# Altium schematic sheet SENSORS.SchDoc
size A4
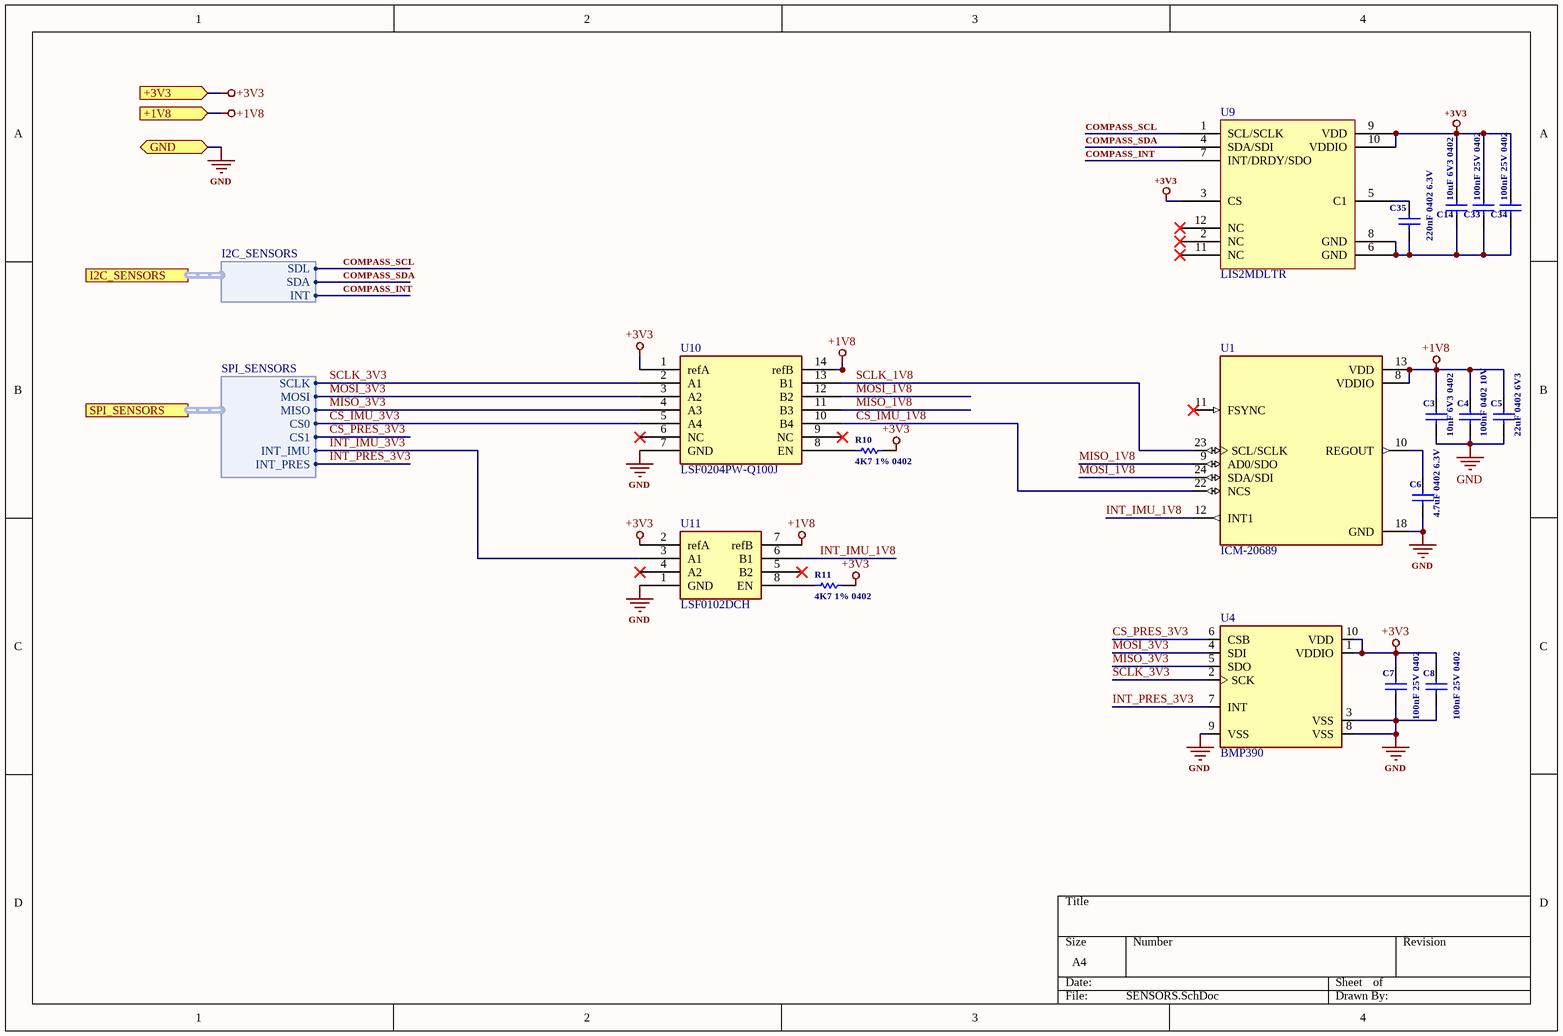
[diagram p0: SENSORS.SchDoc]

## Parts
C3  10nF 6V3 0402
C4  100nF 0402 10V
C5  22uF 0402 6V3
C6  4.7uF 0402 6.3V
C7  100nF 25V 0402
C8  100nF 25V 0402
C14  10uF 6V3 0402
C33  100nF 25V 0402
C34  100nF 25V 0402
C35  220nF 0402 6.3V
R10  4K7 1% 0402  [Resistor_0402]
R11  4K7 1% 0402  [Resistor_0402]
U1  ICM-20689
U4  BMP390
U9  LIS2MDLTR
U10  LSF0204PW-Q100J  [TSOP65P640X110-14N]
U11  LSF0102DCH

## Ports
+1V8 (in), +3V3 (in), GND (bidir), I2C_SENSORS (harness I2C_SENSORS), SPI_SENSORS (harness SPI_SENSORS)

## Harnesses
SPI_SENSORS: SCLK, MOSI, MISO, CS0, CS1, INT_IMU, INT_PRES
I2C_SENSORS: SDL, SDA, INT

## Nets
+1V8: C3.2 C4.2 C5.2 U1.8(VDDIO) U1.13(VDD) U10.14(refB) U11.7(refB) ; port +1V8
+3V3: C7.2 C8.2 C14.2 C33.2 C34.2 R10.2 R11.2 U4.1(VDDIO) U4.10(VDD) U9.3(CS) U9.9(VDD) U9.10(VDDIO) U10.1(refA) U11.2(refA) ; port +3V3
GND: C3.1 C4.1 C5.1 C6.1 C7.1 C8.1 U1.18(GND) U4.3(VSS) U4.8(VSS) U4.9(VSS) U10.7(GND) U11.1(GND) ; port GND
COMPASS_INT: U9.7(INT/DRDY/SDO) ; port I2C_SENSORS.INT
COMPASS_SCL: U9.1(SCL/SCLK) ; port I2C_SENSORS.SDL
COMPASS_SDA: U9.4(SDA/SDI) ; port I2C_SENSORS.SDA
CS_IMU_1V8: U1.22(NCS) U10.10(B4)
CS_IMU_3V3: U10.5(A4) ; port SPI_SENSORS.CS0
CS_PRES_3V3: U4.6(CSB) ; port SPI_SENSORS.CS1
INT_IMU_1V8: U1.12(INT1) U11.6(B1)
INT_IMU_3V3: U11.3(A1) ; port SPI_SENSORS.INT_IMU
INT_PRES_3V3: U4.7(INT) ; port SPI_SENSORS.INT_PRES
MISO_1V8: U1.9(AD0/SDO) U10.11(B3)
MISO_3V3: U4.5(SDO) U10.4(A3) ; port SPI_SENSORS.MISO
MOSI_1V8: U1.24(SDA/SDI) U10.12(B2)
MOSI_3V3: U4.4(SDI) U10.3(A2) ; port SPI_SENSORS.MOSI
SCLK_1V8: U1.23(SCL/SCLK) U10.13(B1)
SCLK_3V3: U4.2(SCK) U10.2(A1) ; port SPI_SENSORS.SCLK
NetC6_2: C6.2 U1.10(REGOUT)
NetC14_1: C14.1 C33.1 C34.1 C35.2 U9.6(GND) U9.8(GND)
NetC35_1: C35.1 U9.5(C1)
NetR10_1: R10.1 U10.8(EN)
NetR11_1: R11.1 U11.8(EN)

Not connected (* = marked no-connect by the designer): U1 11(FSYNC)*; U9 2(NC)* 11(NC)* 12(NC)*; U10 6(NC)* 9(NC)*; U11 4(A2)* 5(B2)*

## Library data of the parts
C3 = 04026C103KAT2A  10nF 6.3V: Supplier 1: Digi-Key; Supplier Part Number 1: 478-04026C103KAT2ACT-ND; Value: 10nF 6V3 0402
C4 = CL05A104KP5NNNC 100nF 0402 10V: Cap Ceramic 0.1uF 10V X5R 10% SMD 0402 85C Paper T/R; Manufacturer: Samsung; Capacitance: 100000 pF; Supplier 1: Digi-Key; Manufacturer Part Number: CL05A104KP5NNNC; Stock 1: 5595689; Pricing 1: 1=0.1, 10=0.021, 50=0.0116, 100=0.0094, 500=0.0067, 1000=0.0053, 2500=0.0048, 5000=0.0044 (USD); Case Size/Dimension: 0402; Dielectric: X5R; Tolerance (%): ±10 %; Rated Voltage: 10 V; ComponentLink1URL: https://www.distrelec.biz/Web/Downloads/_e/ng/MLCC_CatalogDownload2013_ENG.pdf?mime=application%2Fpdf&src-supplier=Distrelec; ComponentLink1Description: https://www.distrelec.biz/Web/Downloads/_e/ng/MLCC_CatalogDownload2013_ENG.pdf?mime=application%2Fpdf&src-supplier=Distrelec; ComponentLink2URL: https://media.digikey.com/pdf/Data%20Sheets/Samsung%20PDFs/CL_Series_MLCC_ds.pdf?src-supplier=Digi-Key; ComponentLink2Description: https://media.digikey.com/pdf/Data%20Sheets/Samsung%20PDFs/CL_Series_MLCC_ds.pdf?src-supplier=Digi-Key; ComponentLink3URL: http://www1.futureelectronics.com/doc/SAMSUNG%20PASSIVE/CL05B104KQ5NNNC.pdf?src-supplier=Future+Electronics; ComponentLink3Description: http://www1.futureelectronics.com/doc/SAMSUNG%20PASSIVE/CL05B104KQ5NNNC.pdf?src-supplier=Future+Electronics; ComponentLink4URL: https://www.verical.com/server-webapp/html/getDatasheet?partID=358611&src-supplier=Verical; ComponentLink4Description: https://www.verical.com/server-webapp/html/getDatasheet?partID=358611&src-supplier=Verical; Supplier Part Number 1: 1276-1022-1-ND; Value: 100nF 0402 10V
C5 = CL05A226MQ5N6J8 22uF 0402 6V3: CL05 Series 22 uF 6.3 V ±20% Tolerance X5R SMT Multilayer Ceramic Capacitor; Manufacturer: Samsung; Categories: Capacitors; Capacitance: 22µF; Voltage - Rated: 6.3V; Supplier 1: Digi-Key; Manufacturer Part Number: CL05A226MQ5N6J8; Stock 1: 135434; Pricing 1: 1=0.53, 10=0.366, 50=0.2564, 100=0.2197, 500=0.1648, 1000=0.1392, 2500=0.1318 (USD); Series: CL; Packaging: Tape & Reel (TR); Part Status: Active; Tolerance: ±20%; Temperature Coefficient: X5R; Operating Temperature: -55°C ~ 85°C; Features: -; Ratings: -; Applications: General Purpose; Failure Rate: -; Mounting Type: Surface Mount, MLCC; Package / Case: 0402 (1005 Metric); Size / Dimension: 0.039 L x 0.020 W (1.00mm x 0.50mm); Height - Seated (Max): -; Thickness (Max): 0.030 (0.75mm); Lead Spacing: -; Lead Style: -; ComponentLink1URL: http://www.samsungsem.com/kr/support/library/product-catalog/mlcc.jsp?src-supplier=Digi-Key; ComponentLink1Description: http://www.samsungsem.com/kr/support/library/product-catalog/mlcc.jsp?src-supplier=Digi-Key; Supplier Part Number 1: 1276-7090-1-ND; Value: 22uF 0402 6V3
C6 = GRM155R60J475ME87D 4.7uF 0402 6.3V: MURATA - GRM155R60J475ME87D - SMD Multilayer Ceramic Capacitor, 4.7 µF, 6.3 V, 0402 [1005 Metric], ± 20%, X5R, GRM Series; Rad Hard: No; Product Depth: 0.5 mm; Voltage: 6.3 Vdc; Product Length: 1 mm; Supplier 1: Digi-Key; Manufacturer: Murata; Manufacturer Part Number: GRM155R60J475ME87D; Stock 1: 78795; Pricing 1: 1=0.14, 10=0.101, 50=0.0572, 100=0.0474, 500=0.0332, 1000=0.0275, 2500=0.0256, 5000=0.0234 (USD); Packaging: Tape & Reel; Package/Case: 0402; Mounting: Surface Mount; Capacitance Value: 4.7 uF; Tolerance: 20 %; Dielectric: X5R; Operating Temperature: -55 to 85 °C; Construction: Flat; Product Height: 0.5 mm; Category: Capacitor Ceramic Multilayer; ComponentLink1URL: https://www.murata.com/~/media/webrenewal/support/library/catalog/products/capacitor/mlcc/c02e.ashx?la=en-us&src-supplier=Digi-Key; ComponentLink1Description: https://www.murata.com/~/media/webrenewal/support/library/catalog/products/capacitor/mlcc/c02e.ashx?la=en-us&src-supplier=Digi-Key; ComponentLink2URL: http://components.arrow.com/part/dataview/47740841S8828489N2606?src-supplier=Arrow+Electronics; ComponentLink2Description: http://components.arrow.com/part/dataview/47740841S8828489N2606?src-supplier=Arrow+Electronics; Supplier Part Number 1: 490-5408-1-ND; Value: 4.7uF 0402 6.3V
C7 C8 C33 C34 = CL05A104KA5NNNC 100nf 0402: 100nF, 25V, MLCC, 0402; Manufacturer: Samsung; Capacitance: 0.1 µF; Dielectric: X5R; Tolerance (%): ±10 %; Supplier 1: Digi-Key; Manufacturer Part Number: CL05A104KA5NNNC; Stock 1: 8000233; Pricing 1: 1=0.1, 10=0.012, 50=0.0064, 100=0.0053, 500=0.0038, 1000=0.003, 2500=0.0027, 5000=0.0025 (USD); Case Size/Dimension: 0402; Rated Voltage: 25 V; ComponentLink1URL: http://www1.futureelectronics.com/doc/SAMSUNG/CL05A104KA5NNNC.pdf?src-supplier=Future+Electronics; ComponentLink1Description: http://www1.futureelectronics.com/doc/SAMSUNG/CL05A104KA5NNNC.pdf?src-supplier=Future+Electronics; ComponentLink2URL: http://www.samsungsem.com/kr/support/product-search/mlcc/CL05A104KA5NNNC.jsp?src-supplier=Digi-Key; ComponentLink2Description: http://www.samsungsem.com/kr/support/product-search/mlcc/CL05A104KA5NNNC.jsp?src-supplier=Digi-Key; ComponentLink3URL: https://www.distrelec.biz/Web/Downloads/_e/ng/MLCC_CatalogDownload2013_ENG.pdf?mime=application%2Fpdf&src-supplier=Distrelec; ComponentLink3Description: https://www.distrelec.biz/Web/Downloads/_e/ng/MLCC_CatalogDownload2013_ENG.pdf?mime=application%2Fpdf&src-supplier=Distrelec; ComponentLink4URL: https://www.verical.com/server-webapp/html/getDatasheet?partID=357412&src-supplier=Verical; ComponentLink4Description: https://www.verical.com/server-webapp/html/getDatasheet?partID=357412&src-supplier=Verical; Supplier Part Number 1: 1276-1043-1-ND; Value: 100nF 25V 0402
C14 = CL05A106MP5NUNC 10uF 0402: CL05A106MP5NUNC CAP CER 10UF 10V X5R 0402; Value: 10uF 6V3 0402; Supplier 1: Digi-Key; Supplier Part Number 1: 1276-1450-1-ND
C35 = CL05B224KO5NNNC 220nF 0402 6.3V: SAMSUNG ELECTRO-MECHANICS - CL05B224KO5NNNC - SMD Multilayer Ceramic Capacitor, 0.22 µF, 16 V, 0402 [1005 Metric], ± 10%, X7R, CL Series; Rated Voltage: 16 V; Supplier 1: Digi-Key; Manufacturer: Samsung; Manufacturer Part Number: CL05B224KO5NNNC; Stock 1: 1886603; Pricing 1: 1=0.1, 10=0.033, 50=0.0182, 100=0.0149, 500=0.0106, 1000=0.0084, 2500=0.0076, 5000=0.007 (USD); Capacitance: 220 nF; Case Size/Dimension: 0402; Dielectric: X7R; Tolerance (%): ±10 %; ComponentLink1URL: http://www.samsungsem.com/kr/support/product-search/mlcc/CL05B224KO5NNNC.jsp?src-supplier=Digi-Key; ComponentLink1Description: http://www.samsungsem.com/kr/support/product-search/mlcc/CL05B224KO5NNNC.jsp?src-supplier=Digi-Key; ComponentLink2URL: http://www1.futureelectronics.com/doc/SAMSUNG/CL05B224KO5NNNC.pdf?src-supplier=Future+Electronics; ComponentLink2Description: http://www1.futureelectronics.com/doc/SAMSUNG/CL05B224KO5NNNC.pdf?src-supplier=Future+Electronics; ComponentLink3URL: https://www.verical.com/server-webapp/html/getDatasheet?partID=358459&src-supplier=Verical; ComponentLink3Description: https://www.verical.com/server-webapp/html/getDatasheet?partID=358459&src-supplier=Verical; Supplier Part Number 1: 1276-1176-1-ND; Value: 220nF 0402 6.3V
R10 R11 = AC0402FR-074K7L 4.7K 1% 0402: Thick Film Resistors 1/16W 4.7K ohm 1% AEC-Q200; Manufacturer: Yageo; Resistance: 4.7 kOhms; Power Rating: 62.5 mW (1/16 W); Temperature Coefficient: 100 PPM / C; Voltage Rating: 50 V; Unit Weight: 0.000023 oz; Supplier 1: Digi-Key; Manufacturer Part Number: AC0402FR-074K7L; Stock 1: 3; Pricing 1: 1=0.1, 10=0.021, 100=0.0086, 1000=0.0039, 2500=0.0033, 5000=0.0028 (USD); Product Category: Thick Film Resistors; RoHS: True; Tolerance: 1 %; Case Code - in: 0402; Case Code - mm: 1005; Operating Temperature Range: - 55 C to + 155 C; Series: AC; Brand: Yageo; Height: 0.32 mm; Length: 1 mm; Package / Case: 0402 (1005 metric); Packaging: Reel; Product: Thick Film Resistors SMD; Termination Style: SMD/SMT; Type: Chip Resistor Surface Mount; Width: 0.5 mm; ComponentLink1URL: http://www.mouser.com/ds/2/447/yageodocoutput-1111992.pdf?src-supplier=Mouser; ComponentLink1Description: http://www.mouser.com/ds/2/447/yageodocoutput-1111992.pdf?src-supplier=Mouser; ComponentLink2URL: http://www.yageo.com/documents/recent/PYu-AC_51_RoHS_L_2_revised.pdf?src-supplier=Future+Electronics; ComponentLink2Description: http://www.yageo.com/documents/recent/PYu-AC_51_RoHS_L_2_revised.pdf?src-supplier=Future+Electronics; ComponentLink3URL: http://www.yageo.com/NewPortal/yageodocoutput?fileName=/pdf/R-Chip/PYu-AC_51_RoHS_L_6.pdf&src-supplier=Digi-Key; ComponentLink3Description: http://www.yageo.com/NewPortal/yageodocoutput?fileName=/pdf/R-Chip/PYu-AC_51_RoHS_L_6.pdf&src-supplier=Digi-Key; Supplier Part Number 1: YAG3497CT-ND; Value: 4K7 1% 0402
U1 = ICM-20689: IMU ACCEL/GYRO/COMPI2C/SPI 24QFN; Supplier 1: Digi-Key; Supplier Part Number 1: 1428-1059-6-ND
U10 = LSF0204PW-Q100J: Nivel de voltaje Traductores Bidireccional 1 circuitos 4 canales 120MHz 14-TSSOP; Supplier 1: Digi-Key; Supplier Part Number 1: 1727-LSF0204PW-Q100JCT-ND
U11 = LSF0102DCH: Voltage Level Translator Bidirectional 1 Circuit 2 Channel 100MHz 8-VSSOP; Supplier 1: Digi-Key; Supplier Part Number 1: 1727-LSF0102DCHCT-ND
U4 = BMP390: Supplier 1: Mouser; Supplier Part Number 1: 262-BMP390
U9 = LIS2MDLTR: Supplier 1: Digi-Key; Supplier Part Number 1: 497-17588-1-ND